# Altium schematic sheet Ethernet.SchDoc: Ethernet
size A4; DocumentNumber: MB1167; Revision: B.1; SheetNumber: 7; SheetTotal: 17; Project: STM327x6G-EVAL
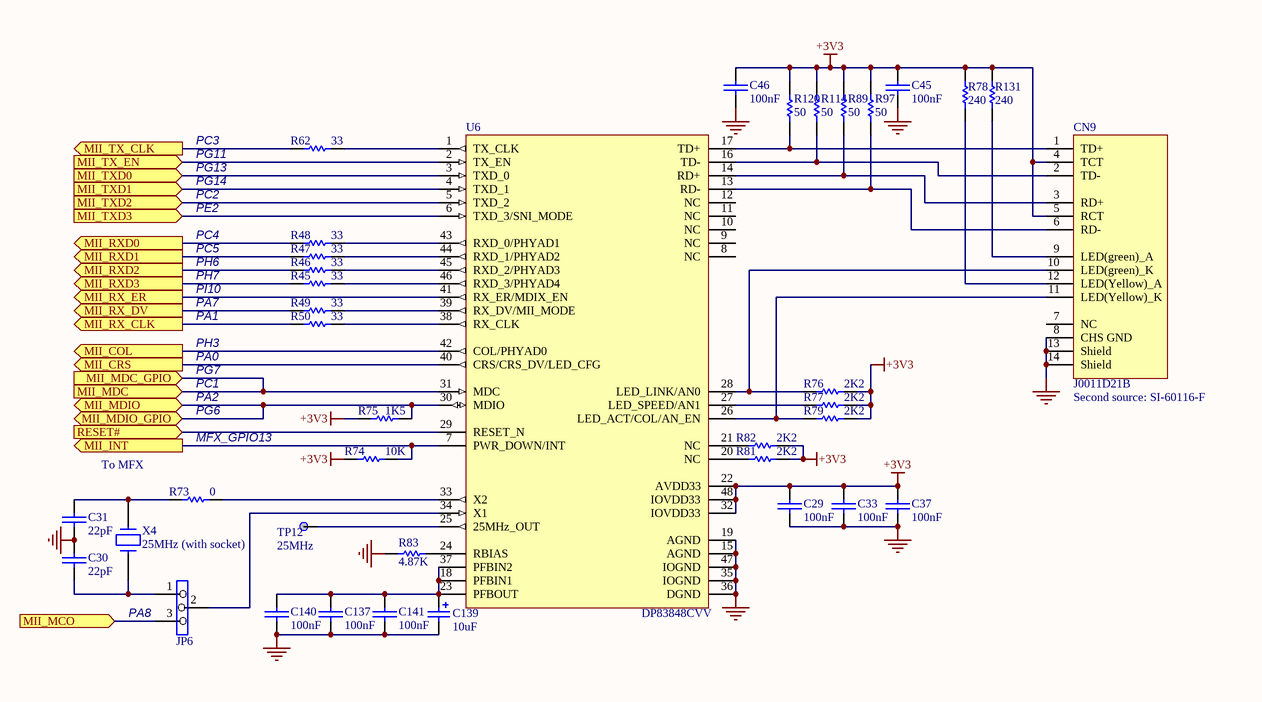
[diagram p0: Ethernet.SchDoc]

## Parts
C29  100nF  [0603C]
C30  22pF  [0603C]
C31  22pF  [0603C]
C33  100nF  [0603C]
C37  100nF  [0603C]
C45  100nF  [0603C]
C46  100nF  [0603C]
C137  100nF  [0603C]
C139  10uF  [TAN-A]
C140  100nF  [0603C]
C141  100nF  [0603C]
CN9  J0011D21B  [RJ45_J0011D01BNL]
JP6  (no value)  [SIP3]
R45  33  [0603R]
R46  33  [0603R]
R47  33  [0603R]
R48  33  [0603R]
R49  33  [0603R]
R50  33  [0603R]
R62  33  [0603R]
R73  0  [0603R]
R74  10K  [0603R]
R75  1K5  [0603R]
R76  2K2  [0603R]
R77  2K2  [0603R]
R78  240  [0603R]
R79  2K2  [0603R]
R81  2K2  [0603R]
R82  2K2  [0603R]
R83  4.87K  [0603R]
R89  50  [0603R]
R97  50  [0603R]
R114  50  [0603R]
R120  50  [0603R]
R131  240  [0603R]
TP12  25MHz  [TP]
U6  DP83848CVV  [LQFP48_0R5_9X9]
X4  25MHz (with socket)  [XTAL_socket]

## Ports
MII_COL (out), MII_CRS (out), MII_INT (out), MII_MCO (in), MII_MDC (in), MII_MDC_GPIO (in), MII_MDIO (bidir), MII_MDIO_GPIO (bidir), MII_RX_CLK (out), MII_RX_DV (out), MII_RX_ER (out), MII_RXD0 (out), MII_RXD1 (out), MII_RXD2 (out), MII_RXD3 (out), MII_TX_CLK (out), MII_TX_EN (in), MII_TXD0 (in), MII_TXD1 (in), MII_TXD2 (in), MII_TXD3 (in), RESET# (in)

## Nets
+3V3: C29.1 C33.2 C37.2 C45.2 C46.2 CN9.4(TCT) CN9.5(RCT) R74.1 R75.2 R76.2 R77.2 R78.2 R79.2 R81.2 R82.2 R89.1 R97.1 R114.1 R120.1 R131.2 U6.22(AVDD33) U6.32(IOVDD33) U6.48(IOVDD33)
GND: C29.2 C30.2 C31.1 C33.1 C37.1 C45.1 C46.1 C137.1 C139.2 C140.2 C141.1 CN9.8(CHS_GND) CN9.13(Shield) CN9.14(Shield) R83.1 U6.15(AGND) U6.19(AGND) U6.35(IOGND) U6.36(DGND) U6.47(IOGND)
MII_COL: U6.42(COL/PHYAD0) ; port MII_COL
MII_CRS: U6.40(CRS/CRS_DV/LED_CFG) ; port MII_CRS
MII_INT: R74.2 U6.7(PWR_DOWN/INT) ; port MII_INT
MII_MCO: JP6.3 ; port MII_MCO
MII_MDC: U6.31(MDC) ; port MII_MDC, port MII_MDC_GPIO
MII_MDIO: R75.1 U6.30(MDIO) ; port MII_MDIO, port MII_MDIO_GPIO
MII_RX_CLK: R50.2 ; port MII_RX_CLK
MII_RX_DV: R49.2 ; port MII_RX_DV
MII_RX_ER: U6.41(RX_ER/MDIX_EN) ; port MII_RX_ER
MII_RXD0: R48.2 ; port MII_RXD0
MII_RXD1: R47.2 ; port MII_RXD1
MII_RXD2: R46.2 ; port MII_RXD2
MII_RXD3: R45.2 ; port MII_RXD3
MII_TX_CLK: R62.2 ; port MII_TX_CLK
MII_TX_EN: U6.2(TX_EN) ; port MII_TX_EN
MII_TXD0: U6.3(TXD_0) ; port MII_TXD0
MII_TXD1: U6.4(TXD_1) ; port MII_TXD1
MII_TXD2: U6.5(TXD_2) ; port MII_TXD2
MII_TXD3: U6.6(TXD_3/SNI_MODE) ; port MII_TXD3
RESET#: U6.29(RESET_N) ; port RESET#
NetC30_1: C30.1 JP6.1 X4.1
NetC31_2: C31.2 R73.2 X4.2
NetC137_2: C137.2 C139.1 C140.1 C141.2 U6.18(PFBIN1) U6.23(PFBOUT) U6.37(PFBIN2)
NetCN9_1: CN9.1(TD+) R120.2 U6.17(TD+)
NetCN9_2: CN9.2(TD-) R114.2 U6.16(TD-)
NetCN9_3: CN9.3(RD+) R89.2 U6.14(RD+)
NetCN9_6: CN9.6(RD-) R97.2 U6.13(RD-)
NetCN9_9: CN9.9(LED(green)_A) R131.1
NetCN9_10: CN9.10(LED(green)_K) R76.1 U6.28(LED_LINK/AN0)
NetCN9_11: CN9.11(LED(Yellow)_K) R79.1 U6.26(LED_ACT/COL/AN_EN)
NetCN9_12: CN9.12(LED(Yellow)_A) R78.1
NetJP6_2: JP6.2 U6.34(X1)
NetR45_1: R45.1 U6.46(RXD_3/PHYAD4)
NetR46_1: R46.1 U6.45(RXD_2/PHYAD3)
NetR47_1: R47.1 U6.44(RXD_1/PHYAD2)
NetR48_1: R48.1 U6.43(RXD_0/PHYAD1)
NetR49_1: R49.1 U6.39(RX_DV/MII_MODE)
NetR50_1: R50.1 U6.38(RX_CLK)
NetR62_1: R62.1 U6.1(TX_CLK)
NetR73_1: R73.1 U6.33(X2)
NetR77_1: R77.1 U6.27(LED_SPEED/AN1)
NetR81_1: R81.1 U6.20(NC)
NetR82_1: R82.1 U6.21(NC)
NetR83_2: R83.2 U6.24(RBIAS)
NetTP12_1: TP12.1 U6.25(25MHz_OUT)

Not connected (* = marked no-connect by the designer): CN9 7(NC); U6 8(NC) 9(NC) 10(NC) 11(NC) 12(NC)

## Notes on the sheet
- PC3
- PG11
- PG13
- PG14
- PC2
- PE2
- PC4
- PC5
- PH6
- PH7
- PI10
- PA7
- PH3
- PA1
- PA0
- PC1
- PA2
- PG7
- PG6
- (near CN9) Second source: SI-60116-F
- To MFX
- MFX_GPIO13
- (near JP6) PA8
- Title:
- Project:
- Size:
- Date:
- A4
- Reference:
- Sheet:
- Revision:
- of

## Library data of the parts
C29-C31 C33 C37 C45 C46 C137 C140 C141 = CAP: Capacitor
C139 = Cap Pol1: Polarized Capacitor (Radial); Published: 8-Jun-2000; Revision: July-2002: Re-released for DXP Platform.; Publisher: Altium Limited; Value: 10uF
JP6 = Jumper3
R45-R50 R62 R73-R79 R81-R83 R89 R97 R114 R120 R131 = Res1: Resistor; Value: 1K; Published: 8-Jun-2000; Revision: July-2002: Re-released for DXP Platform.; Publisher: Altium Limited
TP12 = TP
X4 = CRYSTAL